# Altium schematic sheet dwm1001.SchDoc
size A
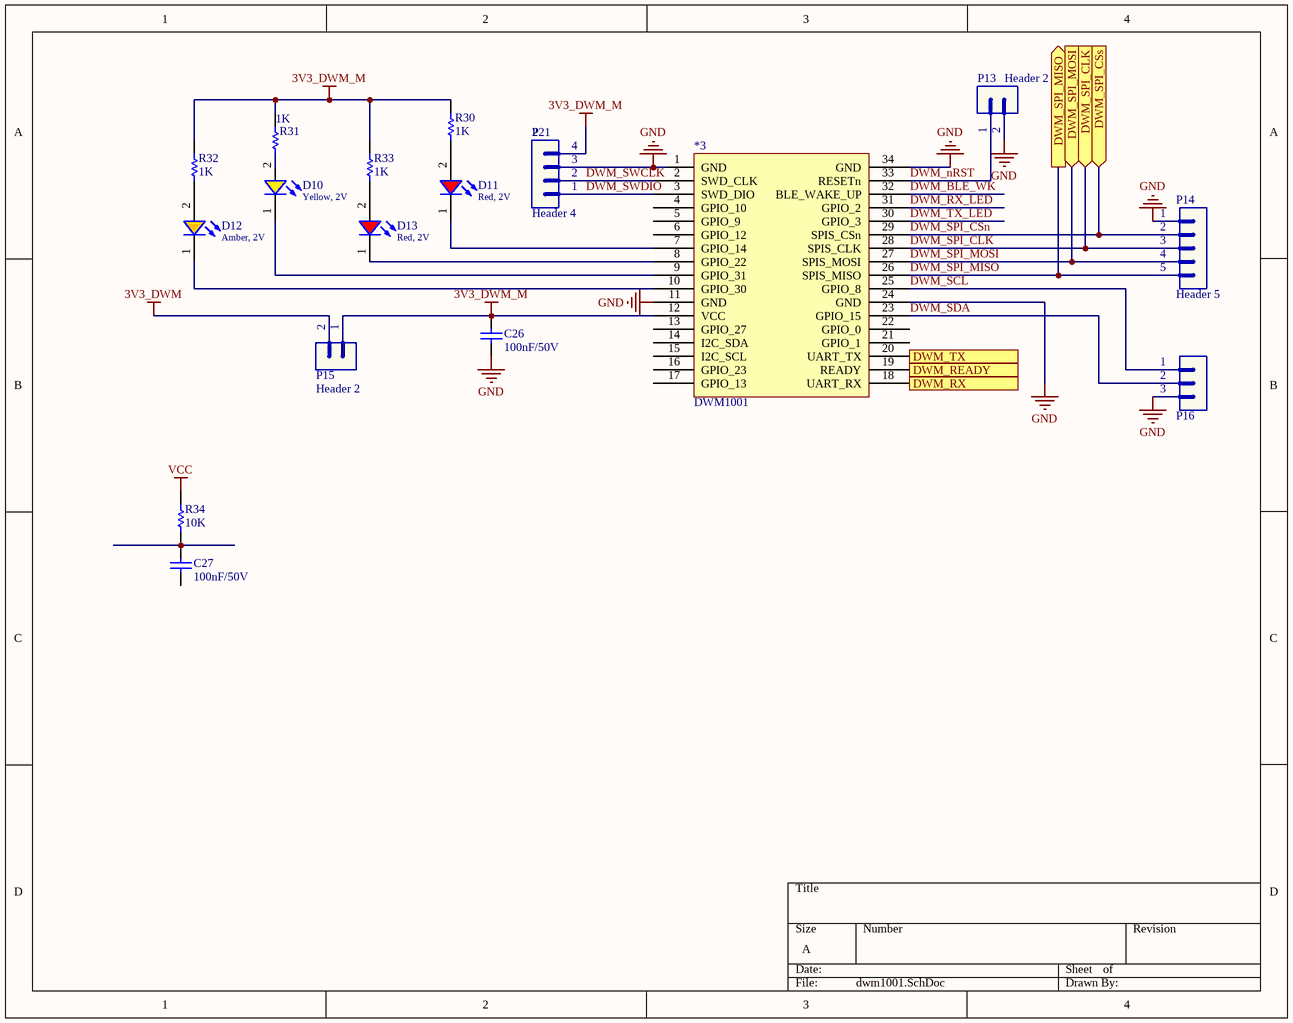
[diagram p0: dwm1001.SchDoc]

## Parts
2  Header 4  [JP4]
*3  DWM1001  [DWM1001]
C26  value 100nF/50V  [CAP-SM-0805]  (hidden comment: Cap-100nF-50V-0805)
C27  value 100nF/50V  [CAP-SM-0805]  (hidden comment: Cap-100nF-50V-0805)
D10  Yellow, 2V  [WL-SMCW_0603_H=0.25mm]
D11  Red, 2V  [WL-SMCW_0603_H=0.25mm]
D12  Amber, 2V  [WL-SMCW_0603_H=0.25mm]
D13  Red, 2V  [WL-SMCW_0603_H=0.25mm]
P13  Header 2  [JP2]
P14  Header 5  [JP5]
P15  Header 2  [JP2]
P16  Header 3  [JP3]  (value not drawn)
R30  value 1K  [RES-SM-0805]  (hidden comment: Res-1K-0805)
R31  value 1K  [RES-SM-0805]  (hidden comment: Res-1K-0805)
R32  value 1K  [RES-SM-0805]  (hidden comment: Res-1K-0805)
R33  value 1K  [RES-SM-0805]  (hidden comment: Res-1K-0805)
R34  value 10K  [RES-SM-0805]  (hidden comment: Res-10k-0805)

## Ports
DWM_READY (out), DWM_RX (in), DWM_SPI_CLK (in), DWM_SPI_CSs (in), DWM_SPI_MISO (out), DWM_SPI_MOSI (in), DWM_TX (out)

## Nets
3V3_DWM: P15.2
3V3_DWM_M: 2.4 *3.12(VCC) C26.2 P15.1 R30.2 R31.2 R32.2 R33.2
GND: 2.3 *3.1(GND) *3.11(GND) *3.24(GND) *3.34(GND) C26.1 P13.2 P14.1 P16.3
VCC: R34.2
DWM_BLE_WK: *3.32(BLE_WAKE_UP)
DWM_nRST: *3.33(RESETn) P13.1
DWM_READY: *3.19(READY) ; port DWM_READY
DWM_RX: *3.18(UART_RX) ; port DWM_RX
DWM_RX_LED: *3.31(GPIO_2)
DWM_SCL: *3.25(GPIO_8) P16.1
DWM_SDA: *3.23(GPIO_15) P16.2
DWM_SPI_CLK: *3.28(SPIS_CLK) P14.3 ; port DWM_SPI_CLK
DWM_SPI_CSn: *3.29(SPIS_CSn) P14.2 ; port DWM_SPI_CSs
DWM_SPI_MISO: *3.26(SPIS_MISO) P14.5 ; port DWM_SPI_MISO
DWM_SPI_MOSI: *3.27(SPIS_MOSI) P14.4 ; port DWM_SPI_MOSI
DWM_SWCLK: 2.2 *3.2(SWD_CLK)
DWM_SWDIO: 2.1 *3.3(SWD_DIO)
DWM_TX: *3.20(UART_TX) ; port DWM_TX
DWM_TX_LED: *3.30(GPIO_3)
Net*3_7: *3.7(GPIO_14) D11.1(K)
Net*3_8: *3.8(GPIO_22) D13.1(K)
Net*3_9: *3.9(GPIO_31) D10.1(K)
Net*3_10: *3.10(GPIO_30) D12.1(K)
NetC27_2: C27.2 R34.1
NetD10_2: D10.2(A) R31.1
NetD11_2: D11.2(A) R30.1
NetD12_2: D12.2(A) R32.1
NetD13_2: D13.2(A) R33.1

Not connected (* = marked no-connect by the designer): *3 4(GPIO_10) 5(GPIO_9) 6(GPIO_12) 13(GPIO_27) 14(I2C_SDA) 15(I2C_SCL) 16(GPIO_23) 17(GPIO_13) 21(GPIO_1) 22(GPIO_0); C27 1

## Notes on the sheet
- (near 2) P21

## Library data of the parts
2 = Header 4: Header, 4-Pin; LatestRevisionDate: 17-Jul-2002; LatestRevisionNote: Re-released for DXP Platform.; Publisher: Altium Limited
C26 C27 = Cap-100nF-50V-0805: CAP CER 0.1UF 50V Y5V 0805; Manufacturer: Samsung Electro-Mechanics; Manufacturer Part Number: CL21F104ZBCNNNC; Local Supplier: thegioiic; Local Supplier Link: https://thegioiic.com/products/tu-100nf-0-1uf-50v-0805; Supplier 1: Digikey; Supplier 1 Part Number: 1276-1007-1-ND; Supplier 1 Link: https://www.digikey.com/product-detail/en/samsung-electro-mechanics/CL21F104ZBCNNNC/1276-1007-1-ND/3889093
D10 = 150060YS75020: WL-SMCW SMT Mono-color Chip LED Waterclear, size 0603, Yellow, 2V, 140deg; Chip Technology: AlInGaP; Dominant Wavelength typ.: 590nm; Luminous Intensity typ.: 130mcd; Peak Wavelength typ.: 595nm; Viewing Angle: 140deg; ComponentLink1Description: Manufacturer; ComponentLink1URL: http://www.we-online.de; ComponentLink2URL: https://www.we-online.com/catalog/datasheet/150060YS75020.pdf; ComponentLink2Description: Datasheet; Forward Voltage typ.: 2V; Emitting Color: Yellow; Mounting Technology: SMT; Operating Temperature: -40 to +85degC; Published Date: March 2020; Part Number: 150060YS75020; Packaging: Tape and Reel; Size: 0603; Publisher: Wurth Elektronik
D11 D13 = 150060RS75020: WL-SMCW SMT Mono-color Chip LED Waterclear, size 0603, Red, 2V, 140deg; Chip Technology: AlInGaP; Dominant Wavelength typ.: 625nm; Luminous Intensity typ.: 100mcd; Peak Wavelength typ.: 630nm; Viewing Angle: 140deg; ComponentLink1Description: Manufacturer; ComponentLink1URL: http://www.we-online.de; ComponentLink2URL: https://www.we-online.com/catalog/datasheet/150060RS75020.pdf; ComponentLink2Description: Datasheet; Forward Voltage typ.: 2V; Emitting Color: Red; Mounting Technology: SMT; Operating Temperature: -40 to +85degC; Published Date: March 2020; Part Number: 150060RS75020; Packaging: Tape and Reel; Size: 0603; Publisher: Wurth Elektronik
D12 = 150060AS75020: WL-SMCW SMT Mono-color Chip LED Waterclear, size 0603, Amber, 2V, 140deg; Chip Technology: AlInGaP; Dominant Wavelength typ.: 605nm; Luminous Intensity typ.: 140mcd; Peak Wavelength typ.: 610nm; Viewing Angle: 140deg; ComponentLink1Description: Manufacturer; ComponentLink1URL: http://www.we-online.de; ComponentLink2URL: https://www.we-online.com/catalog/datasheet/150060AS75020.pdf; ComponentLink2Description: Datasheet; Forward Voltage typ.: 2V; Emitting Color: Amber; Mounting Technology: SMT; Operating Temperature: -40 to +85degC; Published Date: March 2020; Part Number: 150060AS75020; Packaging: Tape and Reel; Size: 0603; Publisher: Wurth Elektronik
P13 P15 = Header 2: Header, 2-Pin; LatestRevisionDate: 17-Jul-2002; LatestRevisionNote: Re-released for DXP Platform.; Publisher: Altium Limited
P14 = Header 5: Header, 5-Pin; LatestRevisionDate: 17-Jul-2002; LatestRevisionNote: Re-released for DXP Platform.; Publisher: Altium Limited
P16 = Header 3: Header, 3-Pin; LatestRevisionDate: 17-Jul-2002; LatestRevisionNote: Re-released for DXP Platform.; Publisher: Altium Limited
R30-R33 = Res-1K-0805: RES 1K OHM 1% 1/4W 0805; Manufacturer: Stackpole Electronics Inc; Manufacturer Part Number: RNCP0805FTD1K00; Local Supplier: thegioiic; Local Supplier Link: https://thegioiic.com/products/dien-tro-1k-ohm-0805-5; Supplier 1: Digikey; Supplier 1 Link: https://www.digikey.com/product-detail/en/stackpole-electronics-inc/RNCP0805FTD1K00/RNCP0805FTD1K00CT-ND/2240568; Supplier 1 Part Number: RNCP0805FTD1K00CT-ND
R34 = Res-10k-0805: RES 10K OHM 1% 1/4W 0805; Manufacturer: Stackpole Electronics Inc; Manufacturer Part Number: RNCP0805FTD10K0; Local Supplier: thegioiic; Local Supplier Link: https://thegioiic.com/products/dien-tro-10k-ohm-0805-5; Supplier 1: Digikey; Supplier 1 Link: https://www.digikey.com/product-detail/en/stackpole-electronics-inc/RNCP0805FTD10K0/RNCP0805FTD10K0CT-ND/2240601; Supplier 1 Part Number: RNCP0805FTD10K0CT-ND